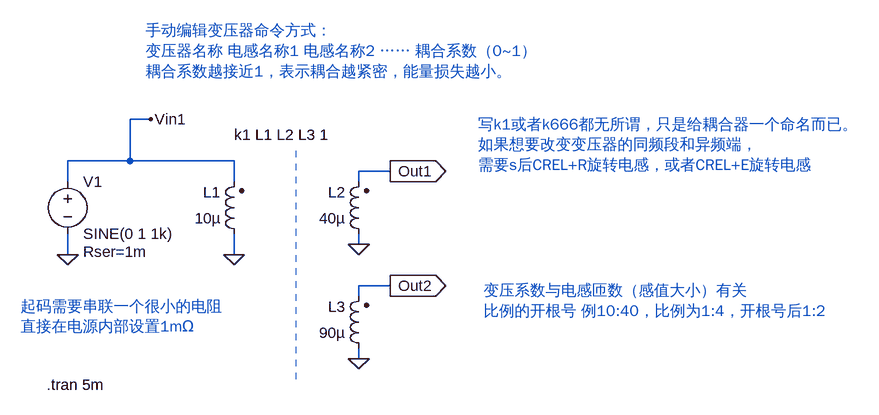
[diagram p0: schematic 13.变压器.asc]
13.变压器.asc, the LTspice schematic file:
Version 4
SHEET 1 1008 680
WIRE -80 224 -112 224
WIRE -112 288 -112 224
WIRE -112 288 -208 288
WIRE 48 288 -112 288
WIRE 288 304 240 304
WIRE -208 320 -208 288
WIRE 48 320 48 288
WIRE 240 320 240 304
WIRE 240 416 240 400
WIRE -208 432 -208 400
WIRE 48 432 48 400
WIRE 288 480 240 480
WIRE 240 496 240 480
WIRE 240 592 240 576
FLAG 48 432 0
FLAG 240 416 0
FLAG 240 592 0
FLAG -208 432 0
FLAG -80 224 Vin1
FLAG 288 304 Out1
IOPIN 288 304 Out
FLAG 288 480 Out2
IOPIN 288 480 Out
SYMBOL ind2 64 416 R180
WINDOW 0 36 80 Left 2
WINDOW 3 36 40 Left 2
SYMATTR InstName L1
SYMATTR Value 10µ
SYMATTR Type ind
SYMBOL ind2 256 416 R180
WINDOW 0 36 80 Left 2
WINDOW 3 36 40 Left 2
SYMATTR InstName L2
SYMATTR Value 40µ
SYMATTR Type ind
SYMBOL ind2 256 592 R180
WINDOW 0 36 80 Left 2
WINDOW 3 36 40 Left 2
SYMATTR InstName L3
SYMATTR Value 90µ
SYMATTR Type ind
SYMBOL voltage -208 304 R0
WINDOW 123 0 0 Left 0
WINDOW 39 24 124 Left 2
SYMATTR InstName V1
SYMATTR Value SINE(0 1 1k)
SYMATTR SpiceLine Rser=1m
TEXT -88 88 Left 2 ;手动编辑变压器命令方式：\n变压器名称 电感名称1 电感名称2 …… 耦合系数（0~1）\n耦合系数越接近1，表示耦合越紧密，能量损失越小。
TEXT 48 248 Left 2 !k1 L1 L2 L3 1
TEXT 424 232 Left 2 ;写k1或者k666都无所谓，只是给耦合器一个命名而已。\n如果想要改变变压器的同频段和异频端，\n需要s后CREL+R旋转电感，或者CREL+E旋转电感
TEXT 432 488 Left 2 ;变压系数与电感匝数（感值大小）有关\n比例的开根号 例10:40，比例为1:4，开根号后1:2
TEXT -240 632 Left 2 !.tran 5m
TEXT -280 512 Left 2 ;起码需要串联一个很小的电阻\n直接在电源内部设置1mΩ
LINE Normal 144 624 144 272 2

The netlist it stands for:
* 13.变压器.asc
L1 0 Vin1 10µ
L2 0 Out1 40µ
L3 0 Out2 90µ
V1 Vin1 0 SINE(0 1 1k) Rser=1m
* 手动编辑变压器命令方式：
* 变压器名称 电感名称1 电感名称2 …… 耦合系数（0~1）
* 耦合系数越接近1，表示耦合越紧密，能量损失越小。
k1 L1 L2 L3 1
* 写k1或者k666都无所谓，只是给耦合器一个命名而已。
* 如果想要改变变压器的同频段和异频端，
* 需要s后CREL+R旋转电感，或者CREL+E旋转电感
* 变压系数与电感匝数（感值大小）有关
* 比例的开根号 例10:40，比例为1:4，开根号后1:2
.tran 5m
* 起码需要串联一个很小的电阻
* 直接在电源内部设置1mΩ
.backanno
.end